# Altium schematic sheet LEDs.SchDoc
size 594 x 420 mm; SheetNumber: 9; PageSetup: Record=PageOptions|CenterHorizontal=False|CenterVertical=False|PrintScale=0.43|XCorrection=0.00|YCorrection=0.00|PrintKind=1|BorderSize=5000000|LeftOffset=0|BottomOffset=0|Orientation=2|PaperLength=5940|PaperWidth=4200|Scale=100|PaperSource=7|PrintQuality=-4|MediaType=1|DitherType=10|PaperKind=Personal. 1: 215,9 x 279,4 mm|PrintScaleMode=0
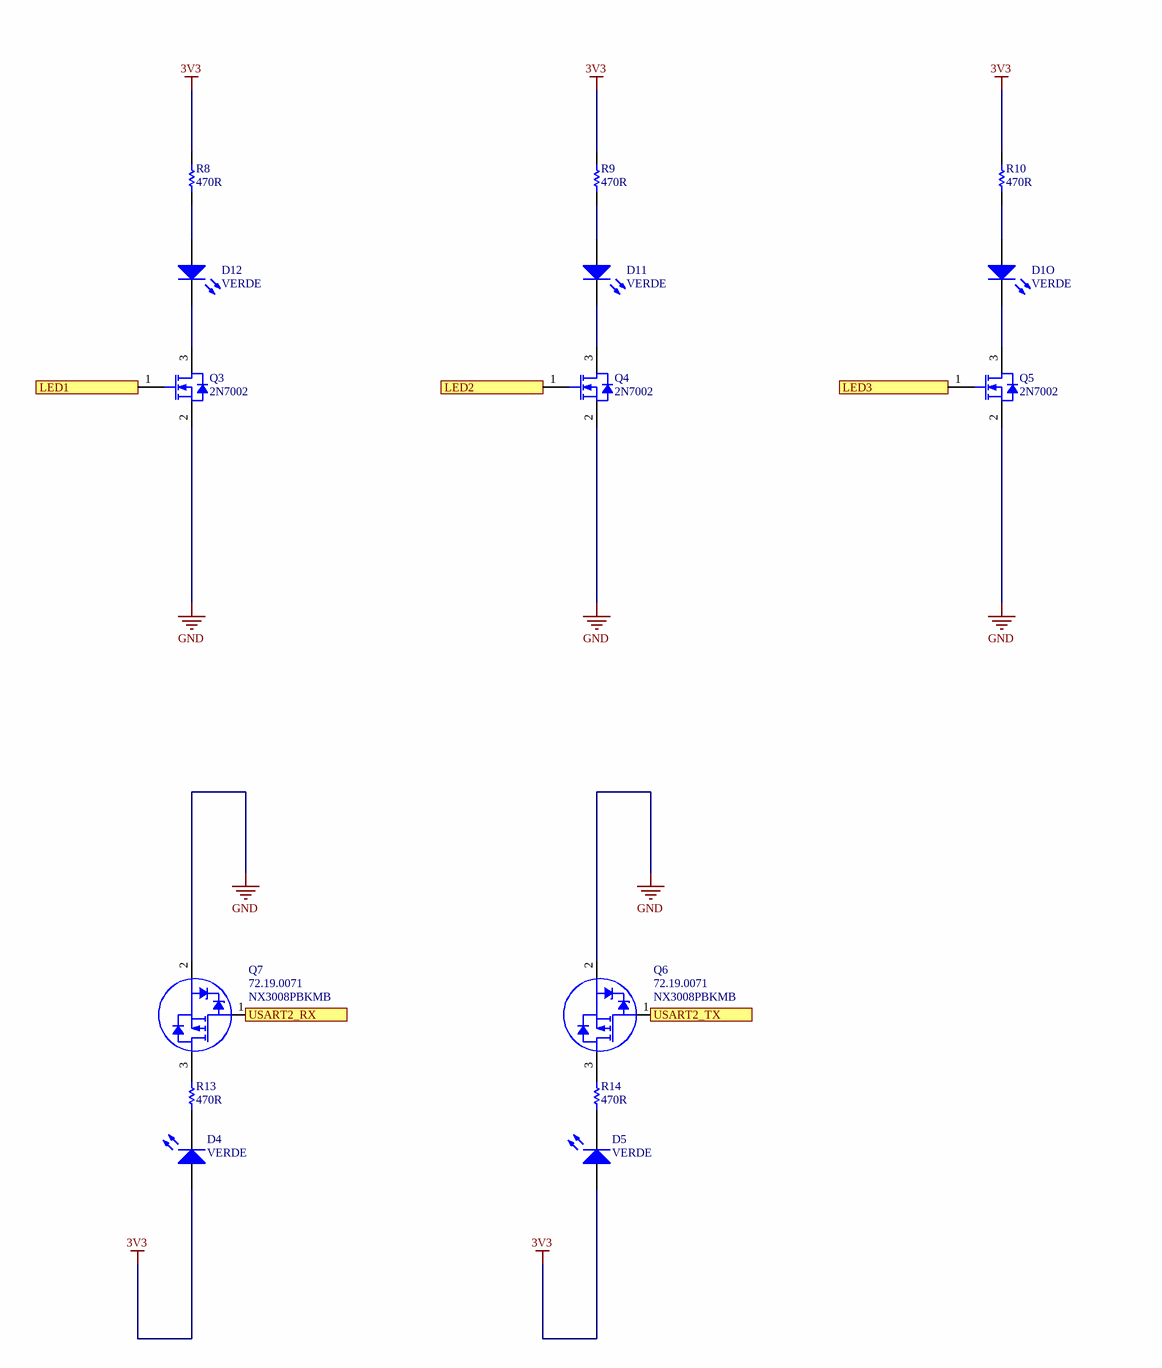
[diagram p0: LEDs.SchDoc, left]
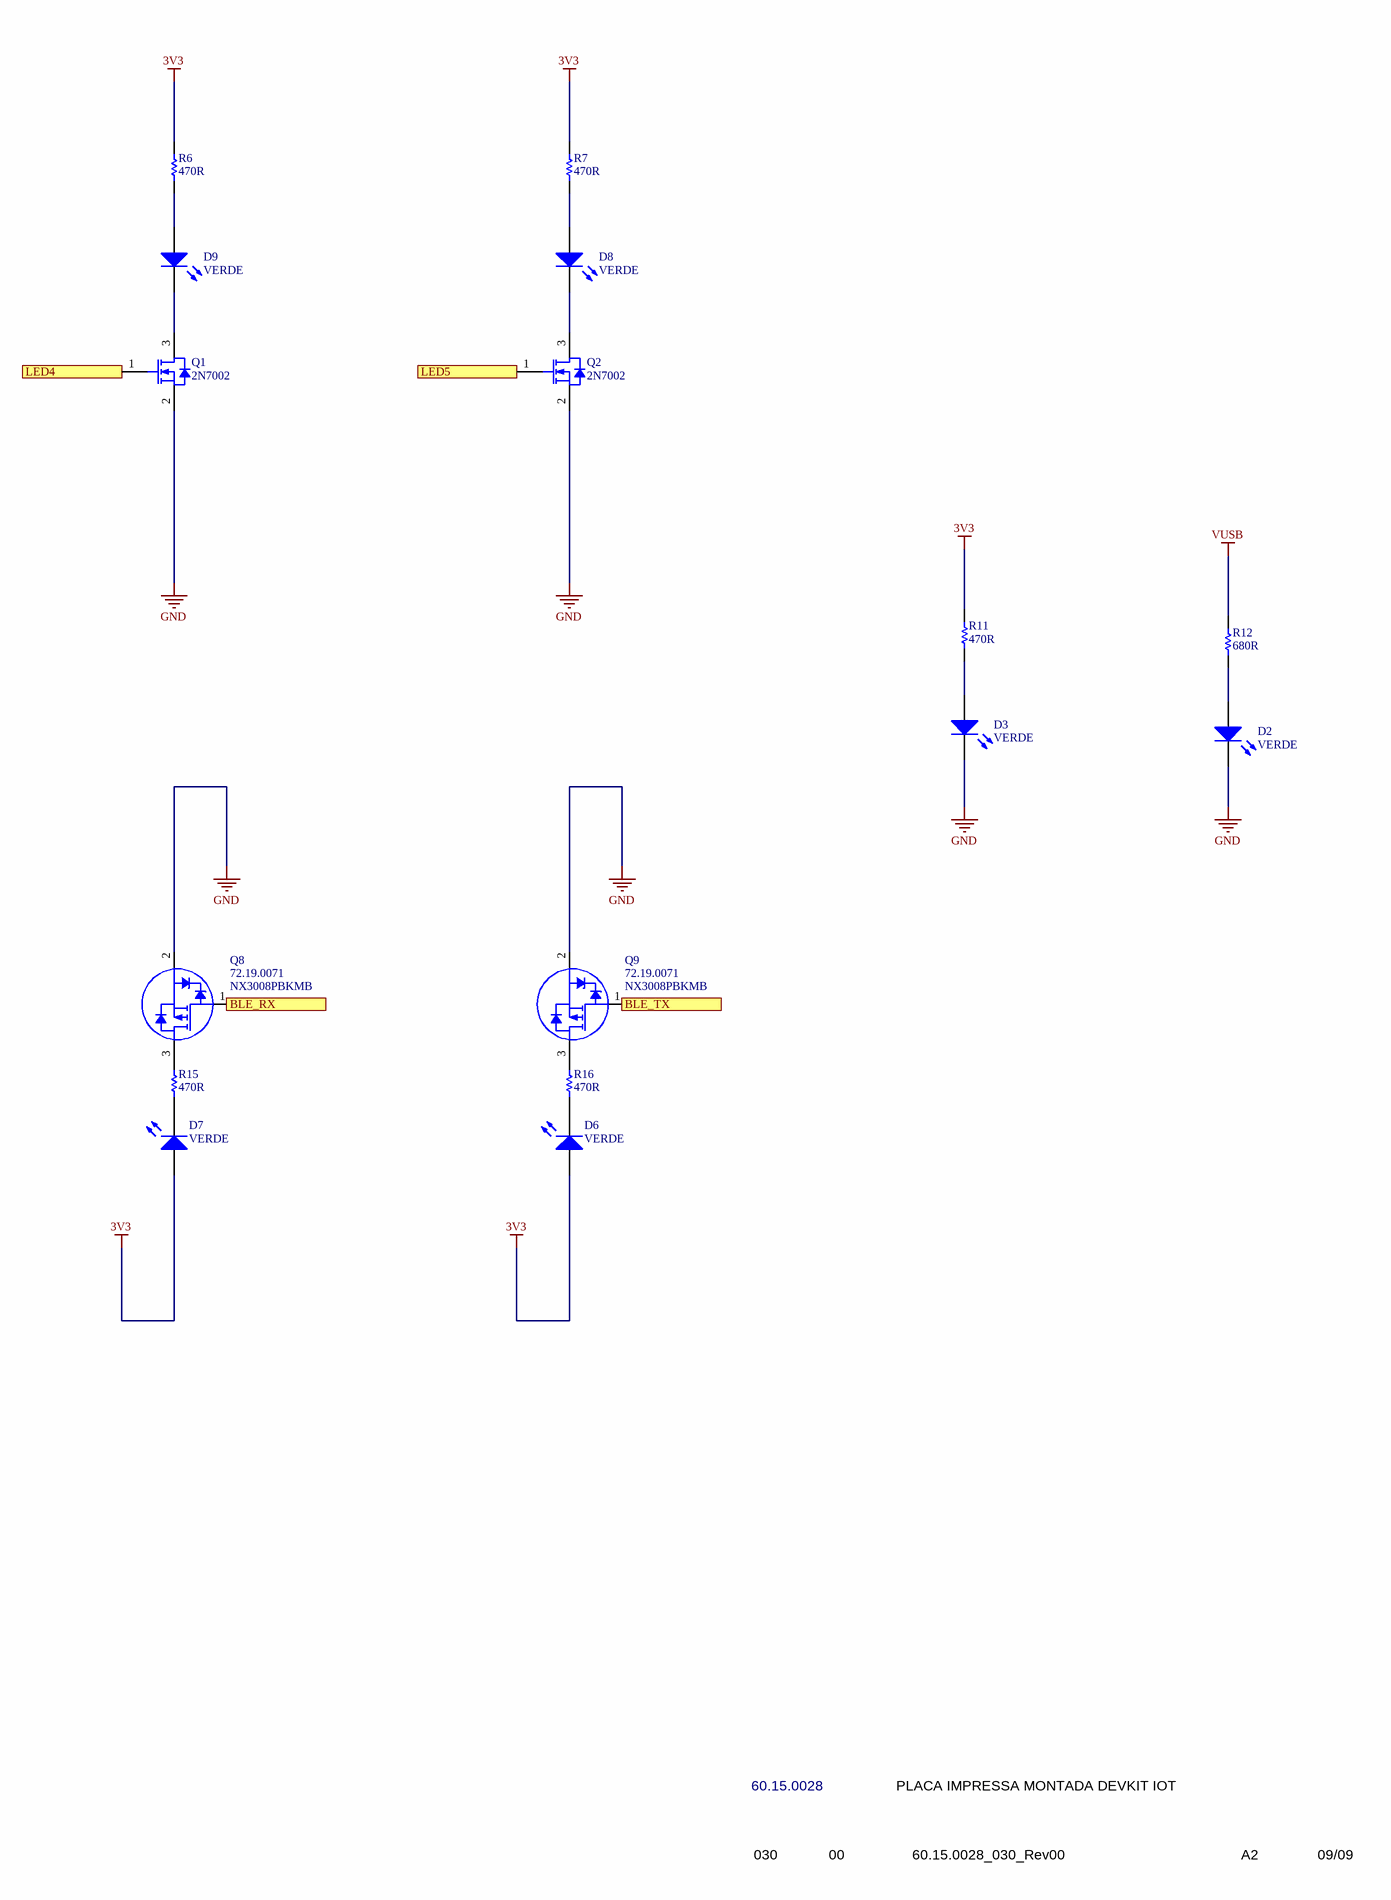
[diagram p1: LEDs.SchDoc, right]

## Parts
D1O  32.17.0022  [32.17.0022]  (value not drawn)
D2  32.17.0022  [32.17.0022]  (value not drawn)
D3  32.17.0022  [32.17.0022]  (value not drawn)
D4  32.17.0022  [32.17.0022]  (value not drawn)
D5  32.17.0022  [32.17.0022]  (value not drawn)
D6  32.17.0022  [32.17.0022]  (value not drawn)
D7  32.17.0022  [32.17.0022]  (value not drawn)
D8  32.17.0022  [32.17.0022]  (value not drawn)
D9  32.17.0022  [32.17.0022]  (value not drawn)
D11  32.17.0022  [32.17.0022]  (value not drawn)
D12  32.17.0022  [32.17.0022]  (value not drawn)
Q1  72.19.0021  [72.19.0021]  (value not drawn)
Q2  72.19.0021  [72.19.0021]  (value not drawn)
Q3  72.19.0021  [72.19.0021]  (value not drawn)
Q4  72.19.0021  [72.19.0021]  (value not drawn)
Q5  72.19.0021  [72.19.0021]  (value not drawn)
Q6  72.19.0071  [72.19.0071]
Q7  72.19.0071  [72.19.0071]
Q8  72.19.0071  [72.19.0071]
Q9  72.19.0071  [72.19.0071]
R6  value 470R  [66.33.4700]  (hidden comment: 66.33.4700)
R7  value 470R  [66.33.4700]  (hidden comment: 66.33.4700)
R8  value 470R  [66.33.4700]  (hidden comment: 66.33.4700)
R9  value 470R  [66.33.4700]  (hidden comment: 66.33.4700)
R10  value 470R  [66.33.4700]  (hidden comment: 66.33.4700)
R11  value 470R  [66.33.4700]  (hidden comment: 66.33.4700)
R12  value 680R  [66.33.6800]  (hidden comment: 66.33.6800)
R13  value 470R  [66.33.4700]  (hidden comment: 66.33.4700)
R14  value 470R  [66.33.4700]  (hidden comment: 66.33.4700)
R15  value 470R  [66.33.4700]  (hidden comment: 66.33.4700)
R16  value 470R  [66.33.4700]  (hidden comment: 66.33.4700)

## Ports
BLE_RX, BLE_TX, LED1, LED2, LED3, LED4, LED5, USART2_RX, USART2_TX

## Nets
3V3: D4.A D5.A D6.A D7.A R6.2 R7.2 R8.2 R9.2 R10.2 R11.2
GND: D2.K D3.K Q1.2(S) Q2.2(S) Q3.2(S) Q4.2(S) Q5.2(S) Q6.2(S) Q7.2(S) Q8.2(S) Q9.2(S)
VUSB: R12.2
BLE_RX: Q8.1(G) ; port BLE_RX
BLE_TX: Q9.1(G) ; port BLE_TX
LED1: Q3.1(G) ; port LED1
LED2: Q4.1(G) ; port LED2
LED3: Q5.1(G) ; port LED3
LED4: Q1.1(G) ; port LED4
LED5: Q2.1(G) ; port LED5
USART2_RX: Q7.1(G) ; port USART2_RX
USART2_TX: Q6.1(G) ; port USART2_TX
NetD1O_A: D1O.A R10.1
NetD1O_K: D1O.K Q5.3(D)
NetD2_A: D2.A R12.1
NetD3_A: D3.A R11.1
NetD4_K: D4.K R13.1
NetD5_K: D5.K R14.1
NetD6_K: D6.K R16.1
NetD7_K: D7.K R15.1
NetD8_A: D8.A R7.1
NetD8_K: D8.K Q2.3(D)
NetD9_A: D9.A R6.1
NetD9_K: D9.K Q1.3(D)
NetD11_A: D11.A R9.1
NetD11_K: D11.K Q4.3(D)
NetD12_A: D12.A R8.1
NetD12_K: D12.K Q3.3(D)
NetQ6_3: Q6.3(D) R14.2
NetQ7_3: Q7.3(D) R13.2
NetQ8_3: Q8.3(D) R15.2
NetQ9_3: Q9.3(D) R16.2

## Notes on the sheet
- 60.15.0028
- PLACA IMPRESSA MONTADA DEVKIT IOT
- 030
- 00
- 60.15.0028_030_Rev00
- A2
- 09/09
- 1
- 2
- 3
- 4
- 5
- 6
- 7
- 8
- A
- B
- C
- D
- E
- F
- G
- H
- DOCUMENTO DE ENGENHARIA DE PRODUTO
- DOCUMENT OF PRODUCT ENGINEERING
- CÓDIGO / CODE
- DESCRIÇÃO / DESCRIPTION
- DOC
- REV
- ARQUIVO / FILE
- FORM./SIZE
- FOLHA / PAGE
- (in symbol 32.17.0022) VERDE
- (in symbol 72.19.0021) 2N7002
- (in symbol 72.19.0071) NX3008PBKMB

## Library data of the parts
D1O D2-D9 D11 D12 = 32.17.0022: LED VERDE SMD 20MA 5V
Q1-Q5 = 72.19.0021: TRANSISTOR MOSFET N 60V 115MA 0.2W SMD
Q6-Q9 = 72.19.0071: MOSFET CANAL P SMD 30V 230mA SOT883B
R6-R11 R13-R16 = 66.33.4700: RES MET 0,125W 470 OHMS 5% SMD 0805
R12 = 66.33.6800: RES MET 0,125W 680 OHMS 5% SMD 0805